# Altium schematic sheet Microcontrolador.SchDoc
size A4; DocumentNumber: 1; SheetNumber: 1; SheetTotal: 11
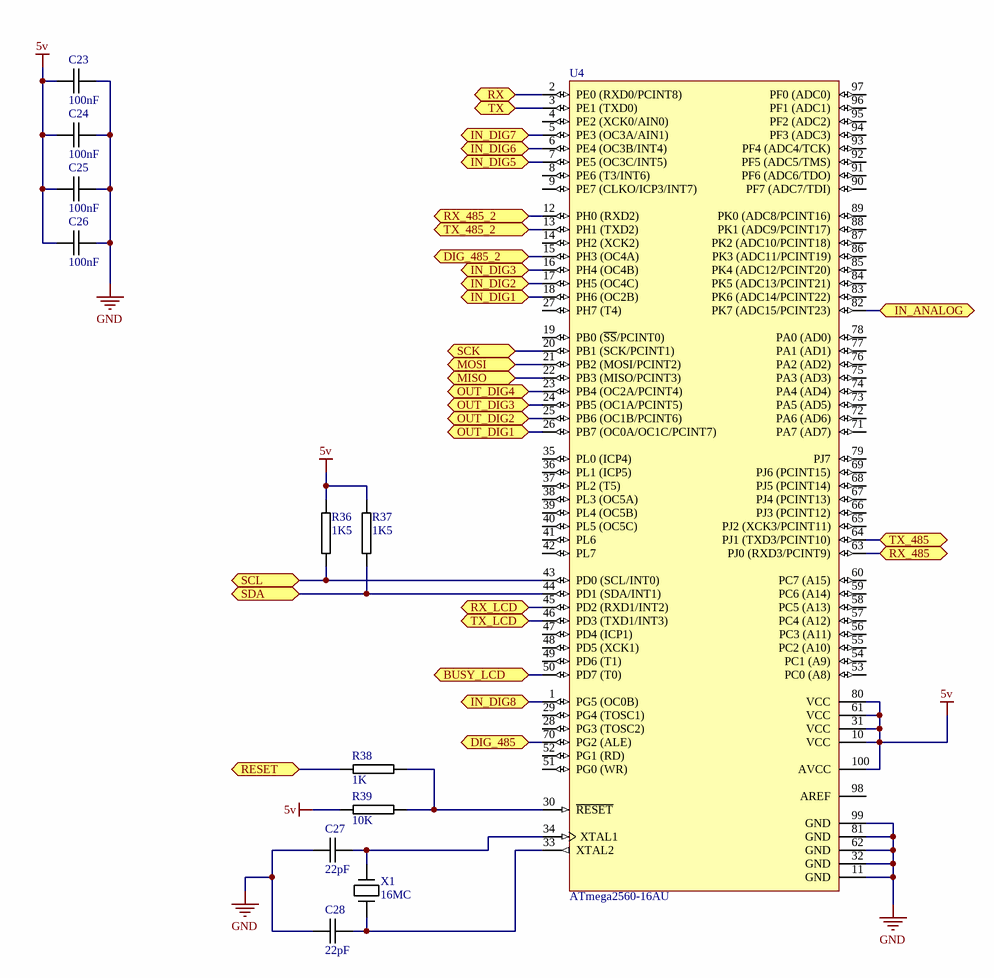
[diagram p0: Microcontrolador.SchDoc]

## Parts
C23  100nF  [0805C-TBD]
C24  100nF  [0805C-TBD]
C25  100nF  [0805C-TBD]
C26  100nF  [0805C-TBD]
C27  22pF  [0603C-GENERIC]
C28  22pF  [0603C-GENERIC]
R36  1K5  [0805R-1K5]
R37  1K5  [0805R-1K5]
R38  1K  [0805R-1K]
R39  10K  [0805R-10K]
U4  ATmega2560-16AU  [100A_N]
X1  16MC  [XTAL-RU49/4]

## Ports
BUSY_LCD, DIG_485, DIG_485_2, IN_ANALOG, IN_DIG1, IN_DIG2, IN_DIG3, IN_DIG5, IN_DIG6, IN_DIG7, IN_DIG8, MISO, MOSI, OUT_DIG1, OUT_DIG2, OUT_DIG3, OUT_DIG4, RESET, RX, RX_485, RX_485_2, RX_LCD, SCK, SCL, SDA, TX, TX_485, TX_485_2, TX_LCD

## Nets
5v: C23.1 C24.1 C25.1 C26.1 R36.1 R37.1 R39.1 U4.10(VCC) U4.31(VCC) U4.61(VCC) U4.80(VCC) U4.100(AVCC)
GND: C23.2 C24.2 C25.2 C26.2 C27.1 C28.1 U4.11(GND) U4.32(GND) U4.62(GND) U4.81(GND) U4.99(GND)
BUSY_LCD: U4.50(PD7_(T0)) ; port BUSY_LCD
DIG_485: U4.70(PG2_(ALE)) ; port DIG_485
DIG_485_2: U4.15(PH3_(OC4A)) ; port DIG_485_2
IN_ANALOG: U4.82(PK7_(ADC15/PCINT23)) ; port IN_ANALOG
IN_DIG1: U4.18(PH6_(OC2B)) ; port IN_DIG1
IN_DIG2: U4.17(PH5_(OC4C)) ; port IN_DIG2
IN_DIG3: U4.16(PH4_(OC4B)) ; port IN_DIG3
IN_DIG5: U4.7(PE5_(OC3C/INT5)) ; port IN_DIG5
IN_DIG6: U4.6(PE4_(OC3B/INT4)) ; port IN_DIG6
IN_DIG7: U4.5(PE3_(OC3A/AIN1)) ; port IN_DIG7
IN_DIG8: U4.1(PG5_(OC0B)) ; port IN_DIG8
MISO: U4.22(PB3_(MISO/PCINT3)) ; port MISO
MOSI: U4.21(PB2_(MOSI/PCINT2)) ; port MOSI
OUT_DIG1: U4.26(PB7_(OC0A/OC1C/PCINT7)) ; port OUT_DIG1
OUT_DIG2: U4.25(PB6_(OC1B/PCINT6)) ; port OUT_DIG2
OUT_DIG3: U4.24(PB5_(OC1A/PCINT5)) ; port OUT_DIG3
OUT_DIG4: U4.23(PB4_(OC2A/PCINT4)) ; port OUT_DIG4
RESET: R38.1 ; port RESET
RX: U4.2(PE0_(RXD0/PCINT8)) ; port RX
RX_485: U4.63(PJ0_(RXD3/PCINT9)) ; port RX_485
RX_485_2: U4.12(PH0_(RXD2)) ; port RX_485_2
RX_LCD: U4.45(PD2_(RXD1/INT2)) ; port RX_LCD
SCK: U4.20(PB1_(SCK/PCINT1)) ; port SCK
SCL: R36.2 U4.43(PD0_(SCL/INT0)) ; port SCL
SDA: R37.2 U4.44(PD1_(SDA/INT1)) ; port SDA
TX: U4.3(PE1_(TXD0)) ; port TX
TX_485: U4.64(PJ1_(TXD3/PCINT10)) ; port TX_485
TX_485_2: U4.13(PH1_(TXD2)) ; port TX_485_2
TX_LCD: U4.46(PD3_(TXD1/INT3)) ; port TX_LCD
NetC27_2: C27.2 U4.34(XTAL1) X1.1
NetC28_2: C28.2 U4.33(XTAL2) X1.2
NetR38_2: R38.2 R39.2 U4.30(~{RESET})

Not connected (* = marked no-connect by the designer): U4 4(PE2_(XCK0/AIN0)) 8(PE6_(T3/INT6)) 9(PE7_(CLKO/ICP3/INT7)) 14(PH2_(XCK2)) 19(PB0_(~{SS}/PCINT0)) 27(PH7_(T4)) 28(PG3_(TOSC2)) 29(PG4_(TOSC1)) 35(PL0_(ICP4)) 36(PL1_(ICP5)) 37(PL2_(T5)) 38(PL3_(OC5A)) 39(PL4_(OC5B)) 40(PL5_(OC5C)) 41(PL6) 42(PL7) 47(PD4_(ICP1)) 48(PD5_(XCK1)) 49(PD6_(T1)) 51(PG0_(WR)) 52(PG1_(RD)) 53(PC0_(A8)) 54(PC1_(A9)) 55(PC2_(A10)) 56(PC3_(A11)) 57(PC4_(A12)) 58(PC5_(A13)) 59(PC6_(A14)) 60(PC7_(A15)) 65(PJ2_(XCK3/PCINT11)) 66(PJ3_(PCINT12)) 67(PJ4_(PCINT13)) 68(PJ5_(PCINT14)) 69(PJ6_(PCINT15)) 71(PA7_(AD7)) 72(PA6_(AD6)) 73(PA5_(AD5)) 74(PA4_(AD4)) 75(PA3_(AD3)) 76(PA2_(AD2)) 77(PA1_(AD1)) 78(PA0_(AD0)) 79(PJ7) 83(PK6_(ADC14/PCINT22)) 84(PK5_(ADC13/PCINT21)) 85(PK4_(ADC12/PCINT20)) 86(PK3_(ADC11/PCINT19)) 87(PK2_(ADC10/PCINT18)) 88(PK1_(ADC9/PCINT17)) 89(PK0_(ADC8/PCINT16)) 90(PF7_(ADC7/TDI)) 91(PF6_(ADC6/TDO)) 92(PF5_(ADC5/TMS)) 93(PF4_(ADC4/TCK)) 94(PF3_(ADC3)) 95(PF2_(ADC2)) 96(PF1_(ADC1)) 97(PF0_(ADC0)) 98(AREF)

## Library data of the parts
C23-C26 = 0805C-100nF-25V-X7R-MUR: CAPACITOR 0805 CERAMIC; Supplier 1: Digi-Key; Supplier Part Number 1: 490-1673-1-ND
C27 C28 = 0603C-22PF-50V-C0G-PAN: CAPACITOR 0603 CERAMIC; Manufacturer Part Number: ECJ-1VC1H220J; Manufacturer: Panasonic - ECG; Reel: C10; Tolerance: ±5%; Temperature Coefficient: C0G, NP0; Voltage - Rated: 50V; Description: CAP CERAMIC 22PF 50V 0603 SMD; Supplier 1: Digi-Key; Features: General Purpose; Lead Spacing: -; Supplier: Digi-Key; Capacitance: 22pF; Packaging: Tape & Reel (TR); Mounting Type: Surface Mount, MLCC; RoHS: RoHS Compliant; Operating Temperature: -55°C ~ 125°C; Thickness: 0.80mm; Package / Case: 0603 (1608 metric); Category: Capacitors; Supplier Part Number 1: PCC220ACVTR-ND; Supplier Part Number: PCC220ACVTR-ND
R36 R37 = 0805R-1K5: RESISTOR 0805 1/4 WATT THIN FILM; Reel: *
R38 = 0805R-1K: RESISTOR 0805 1/4 WATT THIN FILM; Reel: *
R39 = 0805R-10K: RESISTOR 0805 1/4 WATT THIN FILM; Reel: *
U4 = ATmega2560-16AU: 8-bit AVR Microcontroller, 4.5-5.5V, 16MHz, 256KB Flash, 4KB EEPROM, 8KB SRAM, 86 GPIO pins, 100-pin TQFP, Industrial Grade (-40°C to 85°C), Pb-Free; DatasheetVersion: revN, May-2011; PackageVersion: revD, Oct-2010; PackageReference: 100A; PackageDescription: 100-Pin Thin Profile Plastic Quad Flat Pack (TQFP), 14 x 14 x 1.0 mm Body, 0.5 mm Pitch; Code_JEDEC: MS-026-AED; ComponentLink1Description: Manufacturer URL; ComponentLink1URL: http://www.atmel.com/; ComponentLink2Description: ATmega640/1280/1281/2560/2561 Datasheet; ComponentLink2URL: http://www.atmel.com/dyn/resources/prod_documents/doc2549.pdf; ComponentLink3Description: ATmega640/1280/1281/2560/2561 Summary; ComponentLink3URL: http://www.atmel.com/dyn/resources/prod_documents/2549S.pdf
X1 = 16MC-HC49US: 16MHZ CRSYTAL HC49US; Supplier 1: Mouser; Supplier Part Number 1: 815-ABLS-16.0M-T